# EAGLE schematic pic2 (EAGLE 6.5.0)
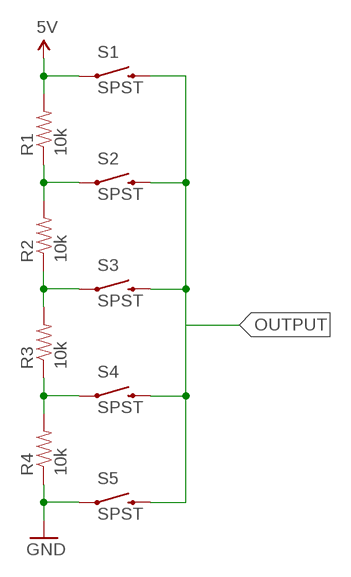
[diagram p0: schematic, sheet 1]

## Parts
R1  10k  330OHM1/10W1%(0603)  [0603-RES]
R2  10k  330OHM1/10W1%(0603)  [0603-RES]
R3  10k  330OHM1/10W1%(0603)  [0603-RES]
R4  10k  330OHM1/10W1%(0603)  [0603-RES]
S1  SPST  SWITCH-MOMENTARY-212MM  [TACTILE-PTH-12MM]
S2  SPST  SWITCH-MOMENTARY-212MM  [TACTILE-PTH-12MM]
S3  SPST  SWITCH-MOMENTARY-212MM  [TACTILE-PTH-12MM]
S4  SPST  SWITCH-MOMENTARY-212MM  [TACTILE-PTH-12MM]
S5  SPST  SWITCH-MOMENTARY-212MM  [TACTILE-PTH-12MM]

## Nets
5V: R1.2 S1.1
GND: R4.1 S5.1
N$4: R2.1 R3.2 S3.1
N$15: R1.1 R2.2 S2.1
N$16: R3.1 R4.2 S4.1
OUTPUT: S1.3 S2.3 S3.3 S4.3 S5.3

## Library data of the parts
R1-R4 = SparkFun-Resistors:330OHM1/10W1%(0603): RES-00818; PROD_ID: RES-00818; VALUE: 330
S1-S5 = SparkFun-Electromechanical:SWITCH-MOMENTARY-2: Various NO switches- pushbuttons, reed, etc; PROD_ID: SWCH-09185